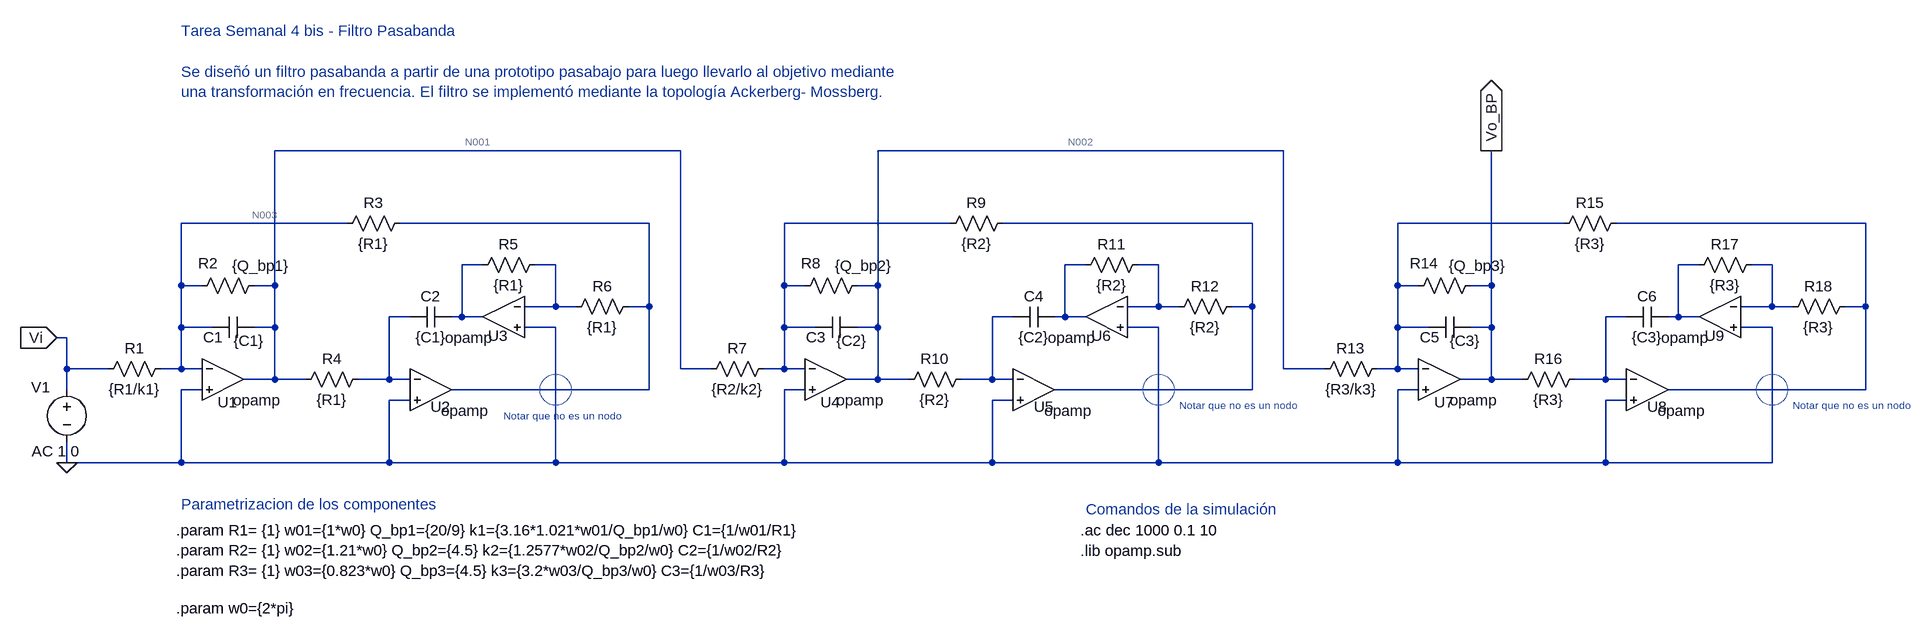
[diagram p0: schematic ts4_bis.asc]
ts4_bis.asc, the LTspice schematic file:
Version 4
SHEET 1 2228 680
WIRE -256 -384 -880 -384
WIRE 672 -384 48 -384
WIRE -768 -272 -1024 -272
WIRE -304 -272 -688 -272
WIRE 160 -272 -96 -272
WIRE 624 -272 240 -272
WIRE 1104 -272 848 -272
WIRE 1568 -272 1184 -272
WIRE -560 -208 -592 -208
WIRE -448 -208 -480 -208
WIRE 368 -208 336 -208
WIRE 480 -208 448 -208
WIRE 1312 -208 1280 -208
WIRE 1424 -208 1392 -208
WIRE -1024 -176 -1024 -272
WIRE -992 -176 -1024 -176
WIRE -880 -176 -880 -384
WIRE -880 -176 -912 -176
WIRE -96 -176 -96 -272
WIRE -64 -176 -96 -176
WIRE 48 -176 48 -384
WIRE 48 -176 16 -176
WIRE 848 -176 848 -272
WIRE 880 -176 848 -176
WIRE 992 -176 992 -384
WIRE 992 -176 960 -176
WIRE -448 -144 -448 -208
WIRE -448 -144 -496 -144
WIRE -416 -144 -448 -144
WIRE -304 -144 -304 -272
WIRE -304 -144 -336 -144
WIRE 480 -144 480 -208
WIRE 480 -144 432 -144
WIRE 512 -144 480 -144
WIRE 624 -144 624 -272
WIRE 624 -144 592 -144
WIRE 1424 -144 1424 -208
WIRE 1424 -144 1376 -144
WIRE 1456 -144 1424 -144
WIRE 1568 -144 1568 -272
WIRE 1568 -144 1536 -144
WIRE -672 -128 -704 -128
WIRE -592 -128 -592 -208
WIRE -592 -128 -608 -128
WIRE -560 -128 -592 -128
WIRE 256 -128 224 -128
WIRE 336 -128 336 -208
WIRE 336 -128 320 -128
WIRE 368 -128 336 -128
WIRE 1200 -128 1168 -128
WIRE 1280 -128 1280 -208
WIRE 1280 -128 1264 -128
WIRE 1312 -128 1280 -128
WIRE -1024 -112 -1024 -176
WIRE -976 -112 -1024 -112
WIRE -880 -112 -880 -176
WIRE -880 -112 -912 -112
WIRE -448 -112 -496 -112
WIRE -96 -112 -96 -176
WIRE -48 -112 -96 -112
WIRE 48 -112 48 -176
WIRE 48 -112 16 -112
WIRE 480 -112 432 -112
WIRE 848 -112 848 -176
WIRE 896 -112 848 -112
WIRE 992 -112 992 -176
WIRE 992 -112 960 -112
WIRE 1424 -112 1376 -112
WIRE -1200 -96 -1216 -96
WIRE -1200 -48 -1200 -96
WIRE -1136 -48 -1200 -48
WIRE -1024 -48 -1024 -112
WIRE -1024 -48 -1056 -48
WIRE -992 -48 -1024 -48
WIRE -256 -48 -256 -384
WIRE -208 -48 -256 -48
WIRE -96 -48 -96 -112
WIRE -96 -48 -128 -48
WIRE -64 -48 -96 -48
WIRE 672 -48 672 -384
WIRE 736 -48 672 -48
WIRE 848 -48 848 -112
WIRE 848 -48 816 -48
WIRE 880 -48 848 -48
WIRE -880 -32 -880 -112
WIRE -880 -32 -928 -32
WIRE -832 -32 -880 -32
WIRE -704 -32 -704 -128
WIRE -704 -32 -752 -32
WIRE -672 -32 -704 -32
WIRE 48 -32 48 -112
WIRE 48 -32 0 -32
WIRE 96 -32 48 -32
WIRE 224 -32 224 -128
WIRE 224 -32 176 -32
WIRE 256 -32 224 -32
WIRE 992 -32 992 -112
WIRE 992 -32 944 -32
WIRE 1040 -32 992 -32
WIRE 1168 -32 1168 -128
WIRE 1168 -32 1120 -32
WIRE 1200 -32 1168 -32
WIRE -1200 -16 -1200 -48
WIRE -992 -16 -1024 -16
WIRE -304 -16 -304 -144
WIRE -304 -16 -608 -16
WIRE -64 -16 -96 -16
WIRE 624 -16 624 -144
WIRE 624 -16 320 -16
WIRE 880 -16 848 -16
WIRE 1568 -16 1568 -144
WIRE 1568 -16 1264 -16
WIRE -672 0 -704 0
WIRE 256 0 224 0
WIRE 1200 0 1168 0
WIRE -1200 96 -1200 64
WIRE -1024 96 -1024 -16
WIRE -1024 96 -1200 96
WIRE -704 96 -704 0
WIRE -704 96 -1024 96
WIRE -448 96 -448 -112
WIRE -448 96 -704 96
WIRE -96 96 -96 -16
WIRE -96 96 -448 96
WIRE 224 96 224 0
WIRE 224 96 -96 96
WIRE 480 96 480 -112
WIRE 480 96 224 96
WIRE 848 96 848 -16
WIRE 848 96 480 96
WIRE 1168 96 1168 0
WIRE 1168 96 848 96
WIRE 1424 96 1424 -112
WIRE 1424 96 1168 96
FLAG -1200 96 0
FLAG -1216 -96 Vi
IOPIN -1216 -96 In
FLAG 992 -384 Vo_BP
IOPIN 992 -384 Out
SYMBOL OpAmps\\opamp -960 -96 R0
WINDOW 0 -8 99 Left 2
SYMATTR InstName U1
SYMBOL OpAmps\\opamp -640 -80 R0
WINDOW 0 0 90 Left 2
SYMATTR InstName U2
SYMBOL OpAmps\\opamp -528 -192 M0
WINDOW 0 -7 93 Left 2
SYMATTR InstName U3
SYMBOL voltage -1200 -32 R0
WINDOW 0 -55 12 Left 2
WINDOW 3 -54 83 Left 2
WINDOW 123 -54 111 Left 2
WINDOW 39 0 0 Left 0
SYMATTR InstName V1
SYMATTR Value ""
SYMATTR Value2 AC 1 0
SYMBOL res -1040 -64 R90
WINDOW 0 0 56 VBottom 2
WINDOW 3 32 56 VTop 2
SYMATTR InstName R1
SYMATTR Value {R1/k1}
SYMBOL res -896 -192 R90
WINDOW 0 -3 87 VBottom 2
WINDOW 3 -30 5 VTop 2
SYMATTR InstName R2
SYMATTR Value {Q_bp1}
SYMBOL cap -912 -128 R90
WINDOW 0 47 63 VBottom 2
WINDOW 3 21 8 VTop 2
SYMATTR InstName C1
SYMATTR Value {C1}
SYMBOL res -672 -288 R90
WINDOW 0 0 56 VBottom 2
WINDOW 3 32 56 VTop 2
SYMATTR InstName R3
SYMATTR Value {R1}
SYMBOL res -736 -48 R90
WINDOW 0 0 56 VBottom 2
WINDOW 3 32 56 VTop 2
SYMATTR InstName R4
SYMATTR Value {R1}
SYMBOL cap -608 -144 R90
WINDOW 0 0 32 VBottom 2
WINDOW 3 32 32 VTop 2
SYMATTR InstName C2
SYMATTR Value {C1}
SYMBOL res -464 -224 R90
WINDOW 0 0 56 VBottom 2
WINDOW 3 32 56 VTop 2
SYMATTR InstName R5
SYMATTR Value {R1}
SYMBOL res -320 -160 R90
WINDOW 0 0 56 VBottom 2
WINDOW 3 32 56 VTop 2
SYMATTR InstName R6
SYMATTR Value {R1}
SYMBOL OpAmps\\opamp -32 -96 R0
WINDOW 0 -8 99 Left 2
SYMATTR InstName U4
SYMBOL OpAmps\\opamp 288 -80 R0
WINDOW 0 0 90 Left 2
SYMATTR InstName U5
SYMBOL OpAmps\\opamp 400 -192 M0
WINDOW 0 -7 93 Left 2
SYMATTR InstName U6
SYMBOL res -112 -64 R90
WINDOW 0 0 56 VBottom 2
WINDOW 3 32 56 VTop 2
SYMATTR InstName R7
SYMATTR Value {R2/k2}
SYMBOL res 32 -192 R90
WINDOW 0 -3 87 VBottom 2
WINDOW 3 -30 5 VTop 2
SYMATTR InstName R8
SYMATTR Value {Q_bp2}
SYMBOL cap 16 -128 R90
WINDOW 0 47 63 VBottom 2
WINDOW 3 21 8 VTop 2
SYMATTR InstName C3
SYMATTR Value {C2}
SYMBOL res 256 -288 R90
WINDOW 0 0 56 VBottom 2
WINDOW 3 32 56 VTop 2
SYMATTR InstName R9
SYMATTR Value {R2}
SYMBOL res 192 -48 R90
WINDOW 0 0 56 VBottom 2
WINDOW 3 32 56 VTop 2
SYMATTR InstName R10
SYMATTR Value {R2}
SYMBOL cap 320 -144 R90
WINDOW 0 0 32 VBottom 2
WINDOW 3 32 32 VTop 2
SYMATTR InstName C4
SYMATTR Value {C2}
SYMBOL res 464 -224 R90
WINDOW 0 0 56 VBottom 2
WINDOW 3 32 56 VTop 2
SYMATTR InstName R11
SYMATTR Value {R2}
SYMBOL res 608 -160 R90
WINDOW 0 0 56 VBottom 2
WINDOW 3 32 56 VTop 2
SYMATTR InstName R12
SYMATTR Value {R2}
SYMBOL OpAmps\\opamp 912 -96 R0
WINDOW 0 -8 99 Left 2
SYMATTR InstName U7
SYMBOL OpAmps\\opamp 1232 -80 R0
WINDOW 0 0 90 Left 2
SYMATTR InstName U8
SYMBOL OpAmps\\opamp 1344 -192 M0
WINDOW 0 -7 93 Left 2
SYMATTR InstName U9
SYMBOL res 832 -64 R90
WINDOW 0 0 56 VBottom 2
WINDOW 3 32 56 VTop 2
SYMATTR InstName R13
SYMATTR Value {R3/k3}
SYMBOL res 976 -192 R90
WINDOW 0 -3 87 VBottom 2
WINDOW 3 -30 5 VTop 2
SYMATTR InstName R14
SYMATTR Value {Q_bp3}
SYMBOL cap 960 -128 R90
WINDOW 0 47 63 VBottom 2
WINDOW 3 21 8 VTop 2
SYMATTR InstName C5
SYMATTR Value {C3}
SYMBOL res 1200 -288 R90
WINDOW 0 0 56 VBottom 2
WINDOW 3 32 56 VTop 2
SYMATTR InstName R15
SYMATTR Value {R3}
SYMBOL res 1136 -48 R90
WINDOW 0 0 56 VBottom 2
WINDOW 3 32 56 VTop 2
SYMATTR InstName R16
SYMATTR Value {R3}
SYMBOL cap 1264 -144 R90
WINDOW 0 0 32 VBottom 2
WINDOW 3 32 32 VTop 2
SYMATTR InstName C6
SYMATTR Value {C3}
SYMBOL res 1408 -224 R90
WINDOW 0 0 56 VBottom 2
WINDOW 3 32 56 VTop 2
SYMATTR InstName R17
SYMATTR Value {R3}
SYMBOL res 1552 -160 R90
WINDOW 0 0 56 VBottom 2
WINDOW 3 32 56 VTop 2
SYMATTR InstName R18
SYMATTR Value {R3}
TEXT -528 24 Left 1 ;Notar que no es un nodo
TEXT -1032 200 Left 2 !.param R1= {1} w01={1*w0} Q_bp1={20/9} k1={3.16*1.021*w01/Q_bp1/w0} C1={1/w01/R1}\n.param R2= {1} w02={1.21*w0} Q_bp2={4.5} k2={1.2577*w02/Q_bp2/w0} C2={1/w02/R2}\n.param R3= {1} w03={0.823*w0} Q_bp3={4.5} k3={3.2*w03/Q_bp3/w0} C3={1/w03/R3}
TEXT 512 8 Left 1 ;Notar que no es un nodo
TEXT 1456 8 Left 1 ;Notar que no es un nodo
TEXT 360 200 Left 2 !.ac dec 1000 0.1 10
TEXT 360 232 Left 2 !.lib opamp.sub
TEXT -1024 160 Left 2 ;Parametrizacion de los componentes
TEXT 368 168 Left 2 ;Comandos de la simulación
TEXT -1024 -568 Left 2 ;Tarea Semanal 4 bis - Filtro Pasabanda\n \nSe diseñó un filtro pasabanda a partir de una prototipo pasabajo para luego llevarlo al objetivo mediante\nuna transformación en frecuencia. El filtro se implementó mediante la topología Ackerberg- Mossberg.
TEXT -1032 320 Left 2 !.param w0={2*pi}
CIRCLE Normal -424 8 -472 -40 2
CIRCLE Normal 504 8 456 -40 2
CIRCLE Normal 1448 8 1400 -40 2

The netlist it stands for:
* ts4_bis.asc
XU1 N003 0 N001 opamp Aol=100K GBW=10Meg  ; pins invin noninvin out
XU2 N015 0 N004 opamp Aol=100K GBW=10Meg  ; pins invin noninvin out
XU3 N010 0 N009 opamp Aol=100K GBW=10Meg  ; pins invin noninvin out
V1 Vi 0 AC 1 0
R1 N003 Vi {R1/k1}
R2 N001 N003 {Q_bp1}
C1 N001 N003 {C1}
R3 N004 N003 {R1}
R4 N015 N001 {R1}
C2 N009 N015 {C1}
R5 N010 N009 {R1}
R6 N004 N010 {R1}
XU4 N005 0 N002 opamp Aol=100K GBW=10Meg  ; pins invin noninvin out
XU5 N016 0 N006 opamp Aol=100K GBW=10Meg  ; pins invin noninvin out
XU6 N012 0 N011 opamp Aol=100K GBW=10Meg  ; pins invin noninvin out
R7 N005 N001 {R2/k2}
R8 N002 N005 {Q_bp2}
C3 N002 N005 {C2}
R9 N006 N005 {R2}
R10 N016 N002 {R2}
C4 N011 N016 {C2}
R11 N012 N011 {R2}
R12 N006 N012 {R2}
XU7 N007 0 Vo_BP opamp Aol=100K GBW=10Meg  ; pins invin noninvin out
XU8 N017 0 N008 opamp Aol=100K GBW=10Meg  ; pins invin noninvin out
XU9 N014 0 N013 opamp Aol=100K GBW=10Meg  ; pins invin noninvin out
R13 N007 N002 {R3/k3}
R14 Vo_BP N007 {Q_bp3}
C5 Vo_BP N007 {C3}
R15 N008 N007 {R3}
R16 N017 Vo_BP {R3}
C6 N013 N017 {C3}
R17 N014 N013 {R3}
R18 N008 N014 {R3}
* Notar que no es un nodo
.param R1= {1} w01={1*w0} Q_bp1={20/9} k1={3.16*1.021*w01/Q_bp1/w0} C1={1/w01/R1}
.param R2= {1} w02={1.21*w0} Q_bp2={4.5} k2={1.2577*w02/Q_bp2/w0} C2={1/w02/R2}
.param R3= {1} w03={0.823*w0} Q_bp3={4.5} k3={3.2*w03/Q_bp3/w0} C3={1/w03/R3}
* Notar que no es un nodo
* Notar que no es un nodo
.ac dec 1000 0.1 10
.lib opamp.sub
* Parametrizacion de los componentes
* Comandos de la simulación
* Tarea Semanal 4 bis - Filtro Pasabanda
* Se diseñó un filtro pasabanda a partir de una prototipo pasabajo para luego llevarlo al objetivo mediante
* una transformación en frecuencia. El filtro se implementó mediante la topología Ackerberg- Mossberg.
.param w0={2*pi}
.backanno
.end

* Results of the author's LTspice run, read from the files saved beside the schematic
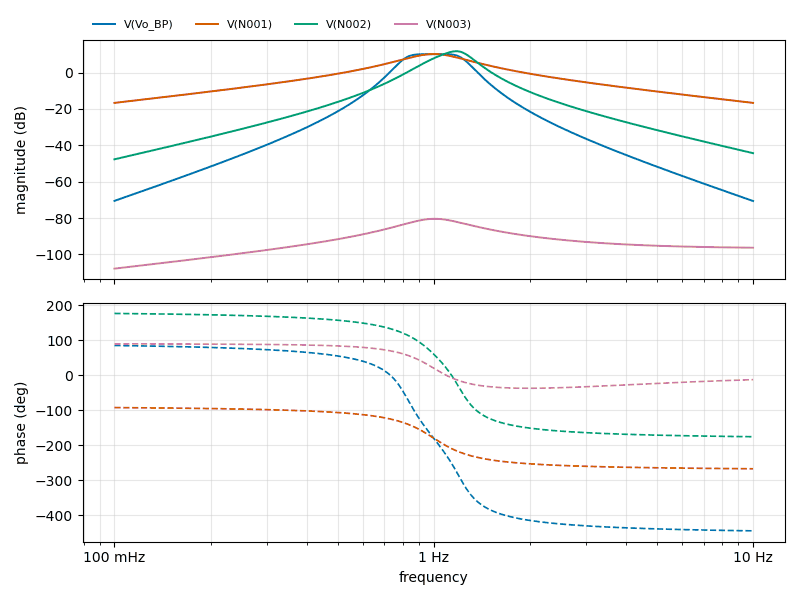
[diagram p1: AC Analysis of ts4_bis.asc, plotted from the saved traces]
* AC Analysis, 1 run:
*   V(Vo_BP): -70.53 dB at 100 mHz, -70.61 dB at 10 Hz, peak 10.10 dB at 1.057 Hz, 3 dB below the peak at 801.4 mHz and 1.244 Hz
*   V(N001): -16.68 dB at 100 mHz, -16.68 dB at 10 Hz, peak 10.17 dB at 1 Hz, 3 dB below the peak at 800 mHz and 1.25 Hz
*   V(N002): -47.70 dB at 100 mHz, -44.32 dB at 10 Hz, peak 11.71 dB at 1.178 Hz, 3 dB below the peak at 1.027 Hz and 1.296 Hz
*   V(N003): -107.77 dB at 100 mHz, -96.28 dB at 10 Hz, peak -80.38 dB at 1.007 Hz, 3 dB below the peak at 807.4 mHz and 1.269 Hz